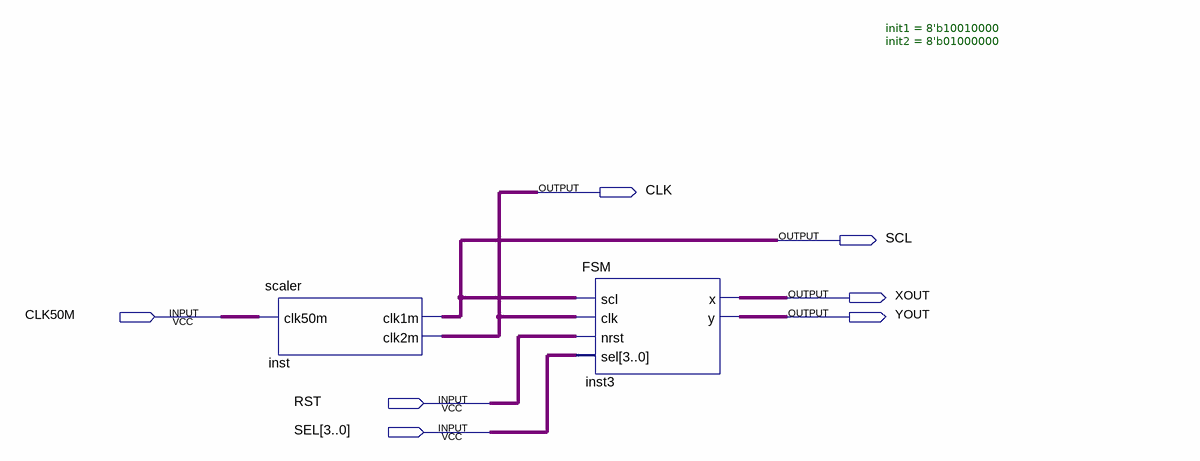
[diagram p0: schematic sheet]
// Quartus schematic 06_Drawing.bdf as structural Verilog: 2 symbols, 7 pins
module \06_Drawing  (
  input  CLK50M,
  input  RST,
  input  [3:0] SEL,
  output CLK,
  output SCL,
  output XOUT,
  output YOUT
);

  scaler inst (.clk50m(CLK50M), .clk1m(SCL), .clk2m(CLK));
  FSM #(.init1(8'b10010000), .init2(8'b01000000)) inst3 (
    .scl(SCL), .clk(CLK), .nrst(RST), .sel(SEL), .x(XOUT), .y(YOUT));
endmodule
